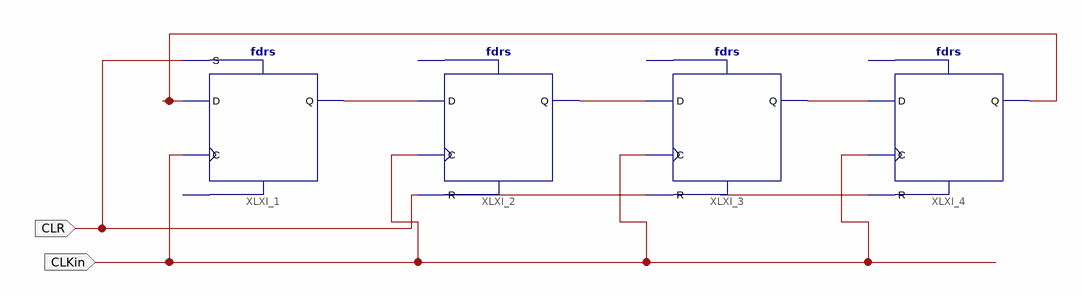
[diagram p0: schematic sheet 1]
// Xilinx ISE schematic experiment7.sch (spartan3e) as structural Verilog: 4 symbols, 2 ports
module experiment7 (
  input  CLR,
  input  CLKin
);

  wire Din, Qout, XLXN_10, XLXN_13, XLXN_14, XLXN_15;

  fdrs XLXI_1 (.C(CLKin), .D(Din), .S(CLR), .Q(Qout));  // open: R
  fdrs XLXI_4 (.C(CLKin), .D(XLXN_15), .R(XLXN_13), .Q(Din));  // open: S
  fdrs XLXI_3 (.C(CLKin), .D(XLXN_14), .R(XLXN_10), .Q(XLXN_15));  // open: S
  fdrs XLXI_2 (.C(CLKin), .D(Qout), .R(CLR), .Q(XLXN_14));  // open: S
endmodule
